# EAGLE design ChargeControllerRevA (EAGLE 7.2.0)
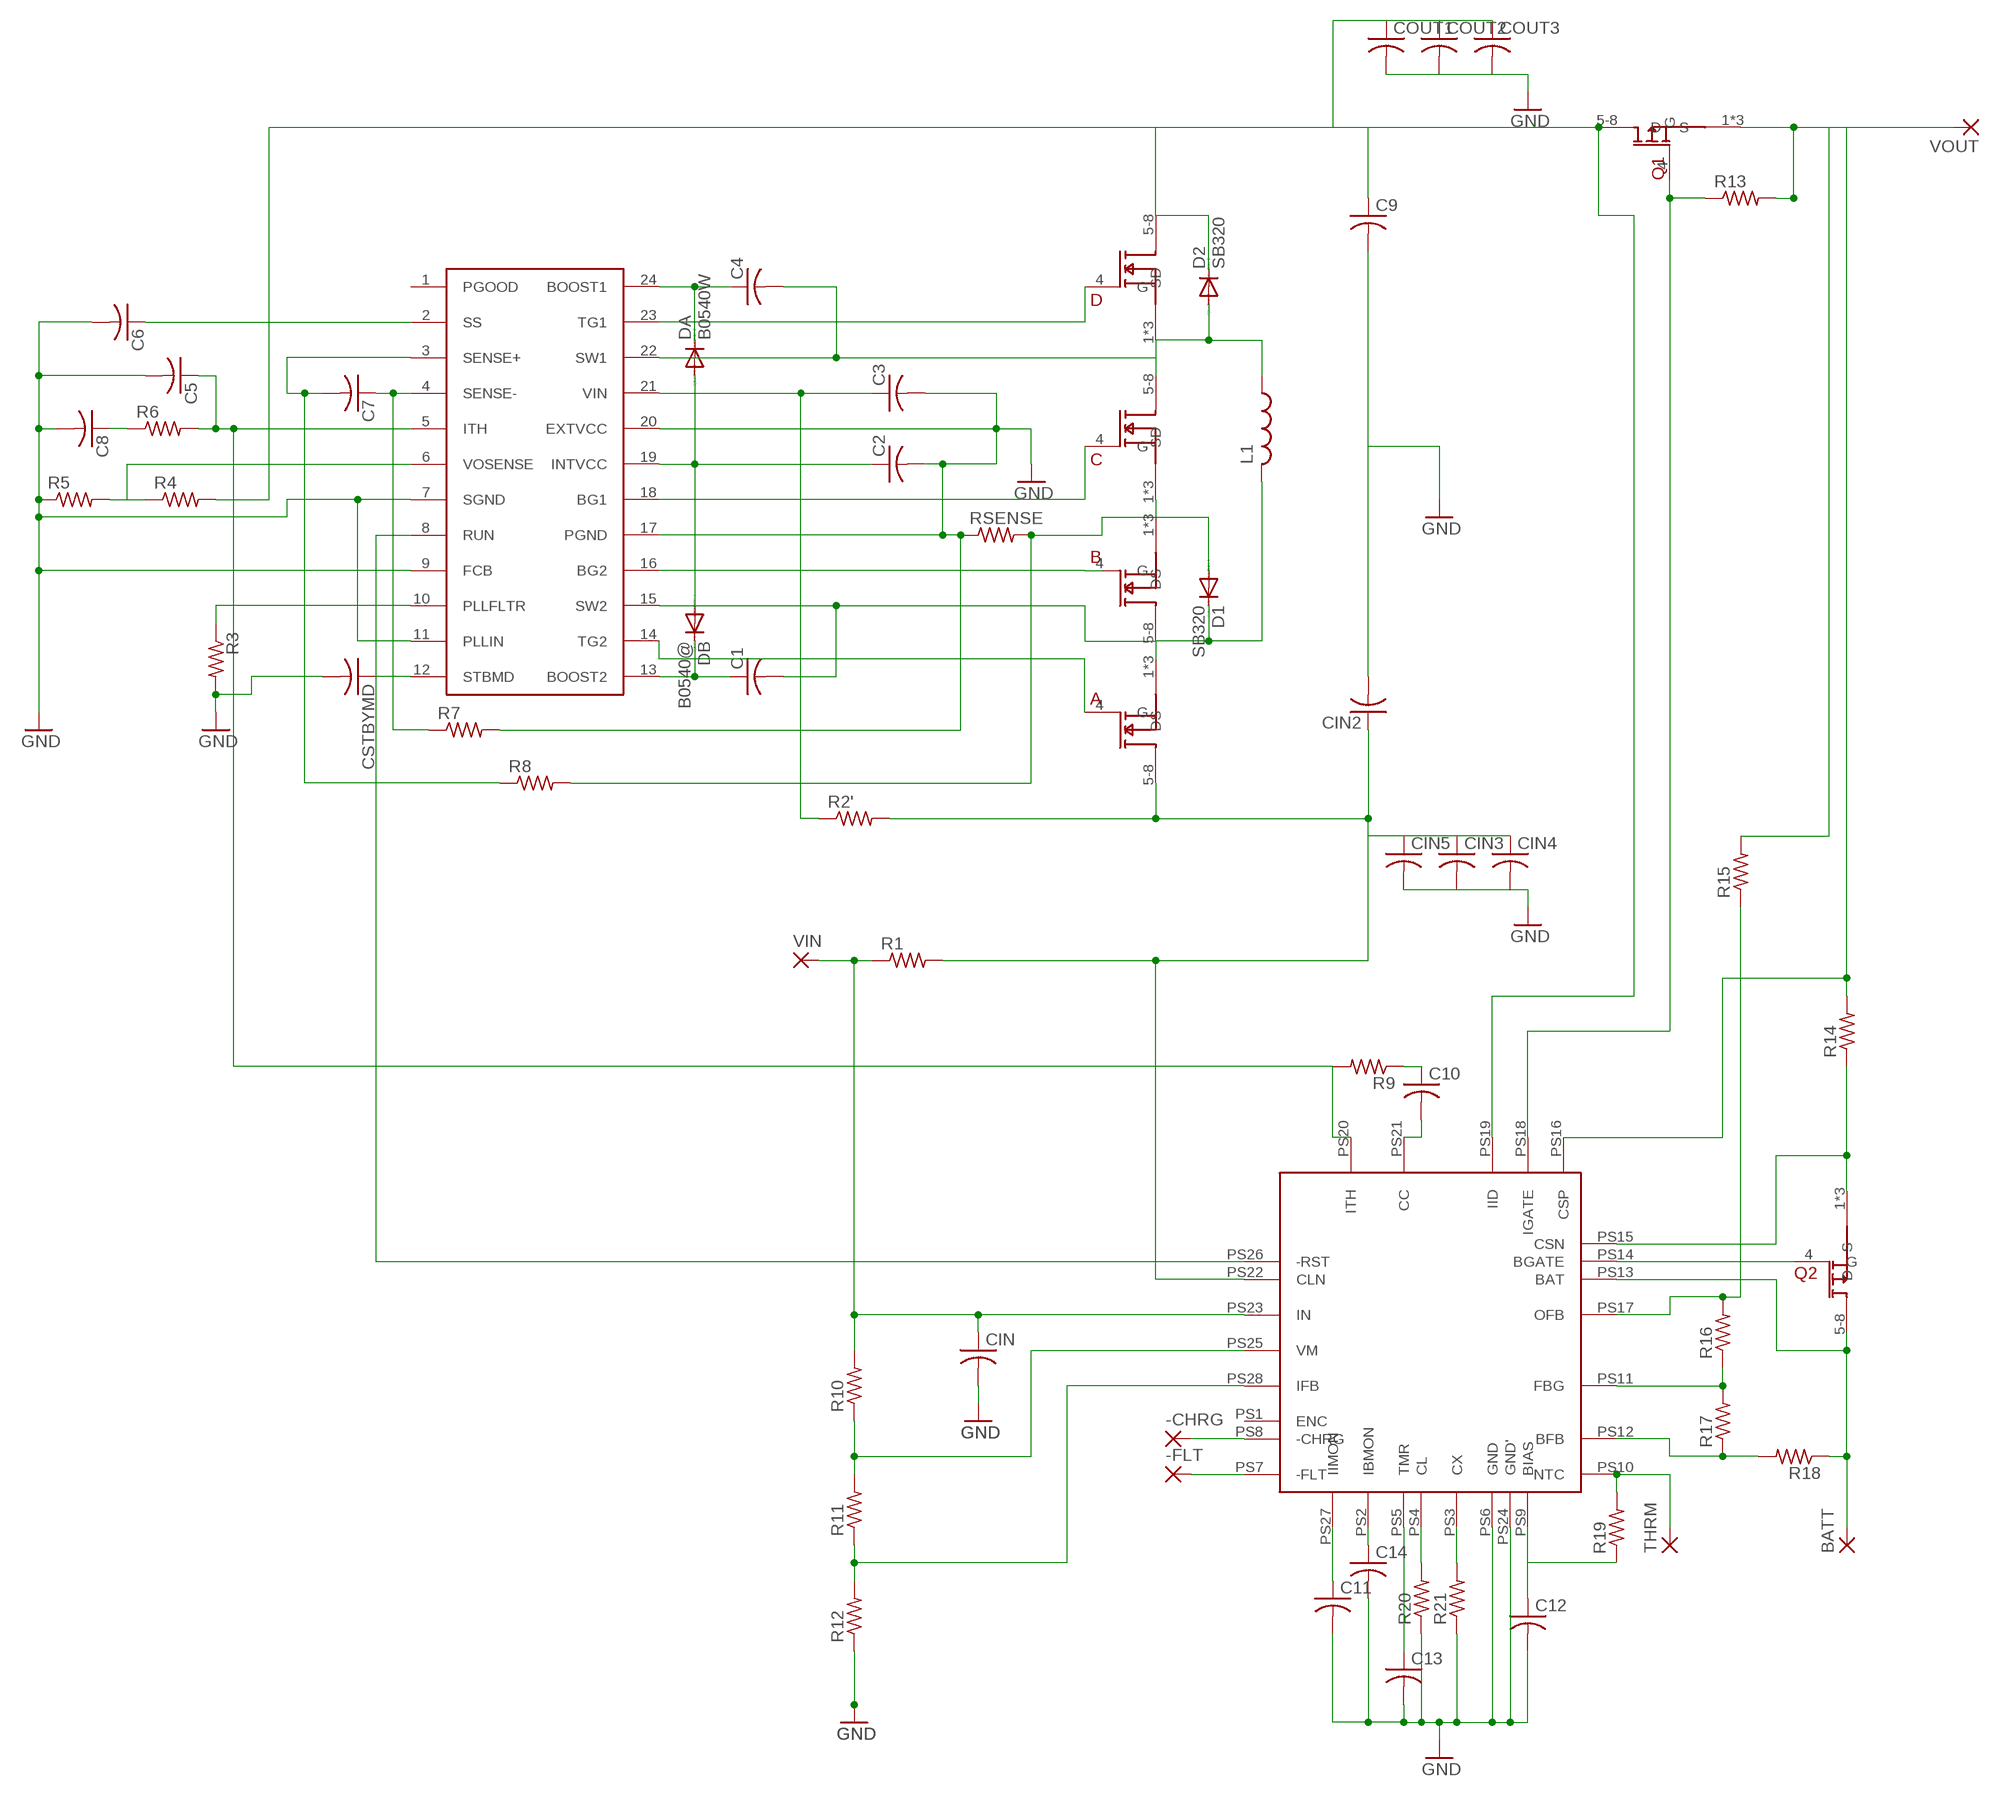
[diagram p0: schematic, sheet 1]

## Parts
-CHRG  3,81/1,4  [3,81/1,4]
-FLT  3,81/1,4  [3,81/1,4]
A  SI7884DP  [POWERPAK-SO-08]
B  SI7884DP  [POWERPAK-SO-08]
BATT  3,81/1,4  [3,81/1,4]
C  SI7884DP  [POWERPAK-SO-08]
C1  C-US025-050X050  [C025-050X050]
C2  C-US025-050X050  [C025-050X050]
C3  C-US025-050X050  [C025-050X050]
C4  C-US025-050X050  [C025-050X050]
C5  C-US025-050X050  [C025-050X050]
C6  C-US025-050X050  [C025-050X050]
C7  C-US025-050X050  [C025-050X050]
C8  C-US025-050X050  [C025-050X050]
C9  C-US025-050X050  [C025-050X050]
C10  C-US025-050X050  [C025-050X050]
C11  C-US025-050X050  [C025-050X050]
C12  C-US025-050X050  [C025-050X050]
C13  C-US025-050X050  [C025-050X050]
C14  C-US025-050X050  [C025-050X050]
CIN  C-US025-050X050  [C025-050X050]
CIN2  C-US025-050X050  [C025-050X050]
CIN3  C-US025-050X050  [C025-050X050]
CIN4  C-US025-050X050  [C025-050X050]
CIN5  C-US025-050X050  [C025-050X050]
COUT1  C-US025-050X050  [C025-050X050]
COUT2  C-US025-050X050  [C025-050X050]
COUT3  C-US025-050X050  [C025-050X050]
CSTBYMD  C-US025-050X050  [C025-050X050]
D  SI7884DP  [POWERPAK-SO-08]
D1  SB320  [DO201-15]
D2  SB320  [DO201-15]
DA  B0540W  MBR0520LT  [SOD123]
DB  B0540@  MBR0520LT  [SOD123]
L1  L-US6000-XXX-RC  [6000-XXXX-RC]
Q1  SI7135DP  [POWERPAK-SO-08]
Q2  SI7135DP  [POWERPAK-SO-08]
R1  R-US_0309/12  [0309/12]
R2'  R-US_0309/12  [0309/12]
R3  R-US_0309/12  [0309/12]
R4  R-US_0309/12  [0309/12]
R5  R-US_0309/12  [0309/12]
R6  R-US_0309/12  [0309/12]
R7  R-US_0309/12  [0309/12]
R8  R-US_0309/12  [0309/12]
R9  R-US_0309/12  [0309/12]
R10  R-US_0309/12  [0309/12]
R11  R-US_0309/12  [0309/12]
R12  R-US_0309/12  [0309/12]
R13  R-US_0309/12  [0309/12]
R14  R-US_0309/12  [0309/12]
R15  R-US_0309/12  [0309/12]
R16  R-US_0309/12  [0309/12]
R17  R-US_0309/12  [0309/12]
R18  R-US_0309/12  [0309/12]
R19  R-US_0309/12  [0309/12]
R20  R-US_0309/12  [0309/12]
R21  R-US_0309/12  [0309/12]
RSENSE  R-US_0309/12  [0309/12]
THRM  3,81/1,4  [3,81/1,4]
U$1  LT3780  [SSOP24]
U$2  LTC4000-1  LTC4000-1(B)GN  [SSOP-28_GN]
VIN  3,81/1,4  [3,81/1,4]
VOUT  3,81/1,4  [3,81/1,4]

## Nets
BATT: BATT.1(P) Q2.5-8(D) R18.1 U$2.PS13(BAT)
GND: C2.2 C3.2 C5.2 C6.2 C8.2 C9.2 C11.2 C12.2 C13.2 C14.2 CIN2.2 CIN3.2 CIN4.2 CIN5.2 CIN.2 COUT1.2 COUT2.2 COUT3.2 CSTBYMD.2 R3.2 R5.1 R7.2 R12.1 R20.1 R21.1 RSENSE.1 U$1.7(SGND) U$1.9(FCB) U$1.11(PLLIN) U$1.17(PGND) U$1.20(EXTVCC) U$2.PS6(GND) U$2.PS24(GND')
N$1: C6.1 U$1.2(SS)
N$2: C7.1 R7.1 U$1.4(SENSE-)
N$3: C7.2 R8.1 U$1.3(SENSE+)
N$4: C5.1 R6.2 R9.2 U$1.5(ITH) U$2.PS20(ITH)
N$5: C8.1 R6.1
N$7: R4.1 R5.2 U$1.6(VOSENSE)
N$9: B.4(G) U$1.16(BG2)
N$10: R3.1 U$1.10(PLLFLTR)
N$11: C4.1 DA.C U$1.24(BOOST1)
N$12: C3.1 R2'.1 U$1.21(VIN)
N$13: C2.1 DA.A DB.A U$1.19(INTVCC)
N$14: CSTBYMD.1 U$1.12(STBMD)
N$16: B.1(S) B.2(S) B.3(S) C.1(S) C.2(S) C.3(S) D1.A R8.2 RSENSE.2
N$17: U$1.8(RUN) U$2.PS26(-RST)
N$19: C10.1 R9.1
N$20: C1.1 DB.C U$1.13(BOOST2)
N$21: Q1.1(S) Q1.2(S) Q1.3(S) R13.2 R14.2 R15.2 U$2.PS16(CSP) VOUT.1(P)
N$22: D.4(G) U$1.23(TG1)
N$23: C.4(G) U$1.18(BG1)
N$24: A.4(G) U$1.14(TG2)
N$25: Q1.4(G) R13.1 U$2.PS18(IGATE)
N$26: C10.2 U$2.PS21(CC)
N$28: R10.1 R11.2 U$2.PS25(VM)
N$29: R11.1 R12.2 U$2.PS28(IFB)
N$31: -FLT.1(P) U$2.PS7(-FLT)
N$32: C11.1 U$2.PS27(IIMON)
N$33: C14.1 U$2.PS2(IBMON)
N$34: C13.1 U$2.PS5(TMR)
N$35: R20.2 U$2.PS4(CL)
N$36: R21.2 U$2.PS3(CX)
N$37: C12.1 R19.1 U$2.PS9(BIAS)
N$38: -CHRG.1(P) U$2.PS8(-CHRG)
N$39: R19.2 THRM.1(P) U$2.PS10(NTC)
N$40: R16.1 R17.2 U$2.PS11(FBG)
N$41: R17.1 R18.2 U$2.PS12(BFB)
N$42: R15.1 R16.2 U$2.PS17(OFB)
N$44: Q2.4(G) U$2.PS14(BGATE)
N$45: Q2.1(S) Q2.2(S) Q2.3(S) R14.1 U$2.PS15(CSN)
SW1: C4.2 C.5-8(D) D2.A D.1(S) D.2(S) D.3(S) L1.1 U$1.22(SW1)
SW2: A.1(S) A.2(S) A.3(S) B.5-8(D) C1.2 D1.C L1.2 U$1.15(SW2)
VIN: A.5-8(D) CIN2.1 CIN3.1 CIN4.1 CIN5.1 R1.2 R2'.2 U$2.PS22(CLN)
VIN+: CIN.1 R1.1 R10.2 U$2.PS23(IN) VIN.1(P)
VOUT(1): C9.1 COUT1.1 COUT2.1 COUT3.1 D2.C D.5-8(D) Q1.5-8(D) R4.2 U$2.PS19(IID)
Unconnected: U$1.1(PGOOD) U$2.PS1(ENC)

## Library data of the parts
-CHRG -FLT BATT THRM VIN VOUT = wirepad:3,81/1,4: THROUGH-HOLE PAD
A B C D = SeniorDesign:SI7884DP
C1-C14 CIN CIN2-CIN5 COUT1-COUT3 CSTBYMD = rcl:C-US: CAPACITOR, American symbol
D1 D2 = diode:SB320: DIODE barrier rectifier, 3 A (Fairchild)
DA DB = diode:MBR0520LT: SCHOTTKY BARRIER RECTIFIER Source: http://onsemi.com .. MBR0520LT1-D.pdf
L1 = rcl:L-US: INDUCTOR, American symbol
Q1 Q2 = SeniorDesign:SI7135DP
R1 R2' R3-R21 RSENSE = rcl:R-US_: RESISTOR, American symbol
U$1 = SeniorDesign:LT3780
U$2 = SeniorDesign:LTC4000-1(B)

## Board
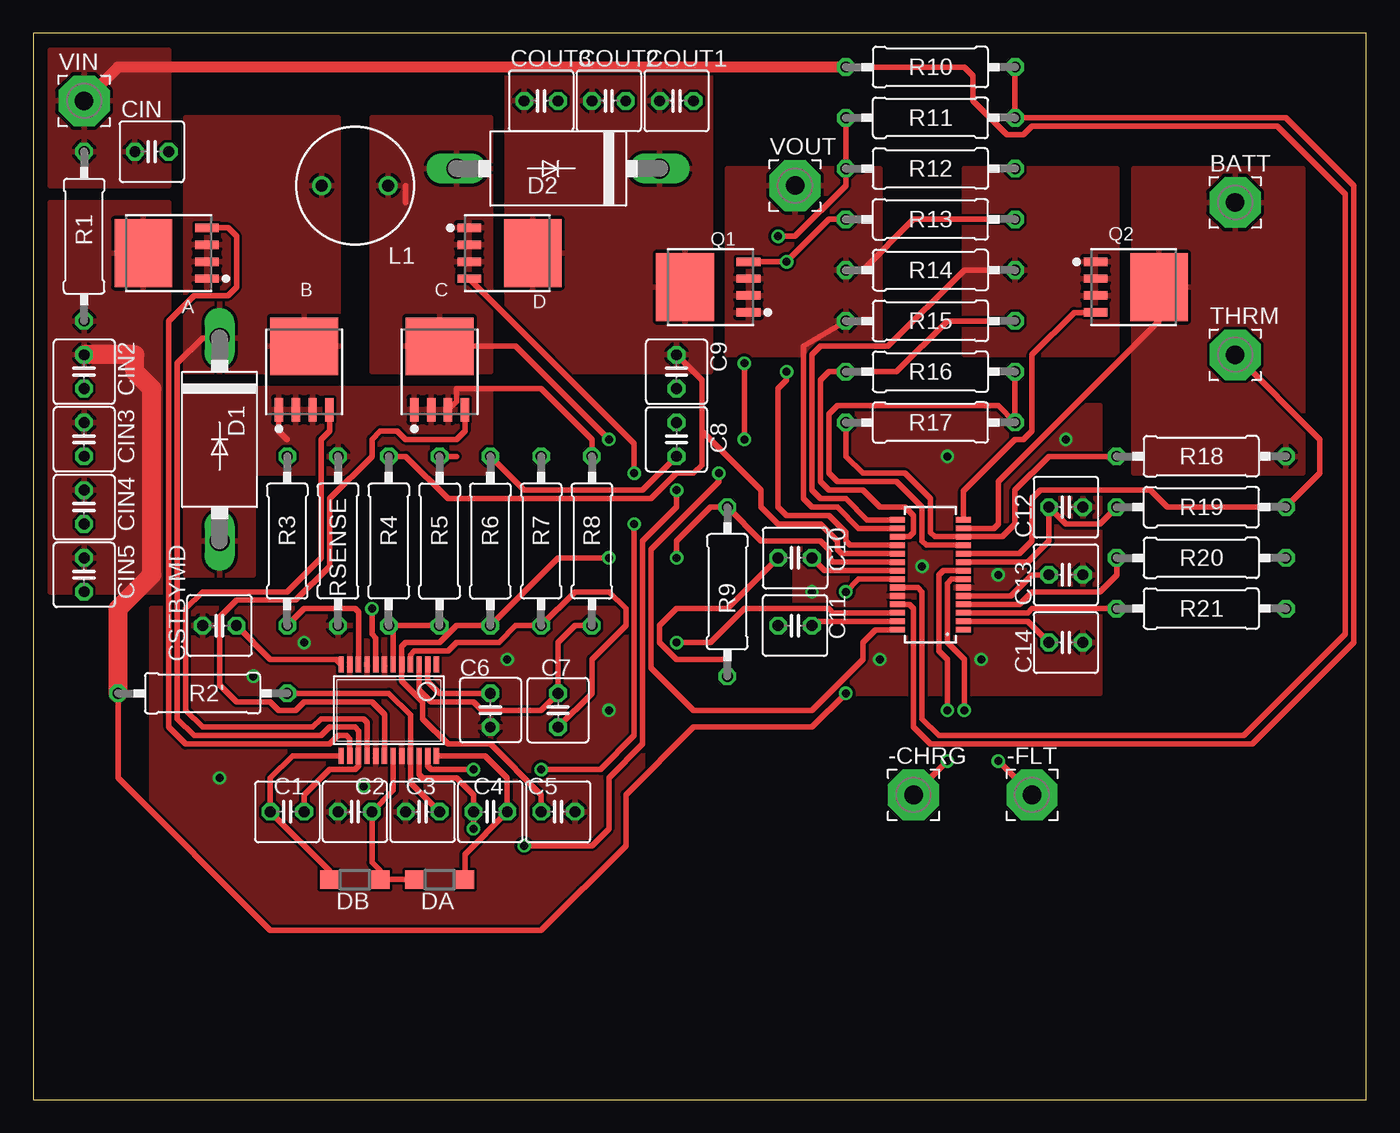
[diagram p1: board, top side]
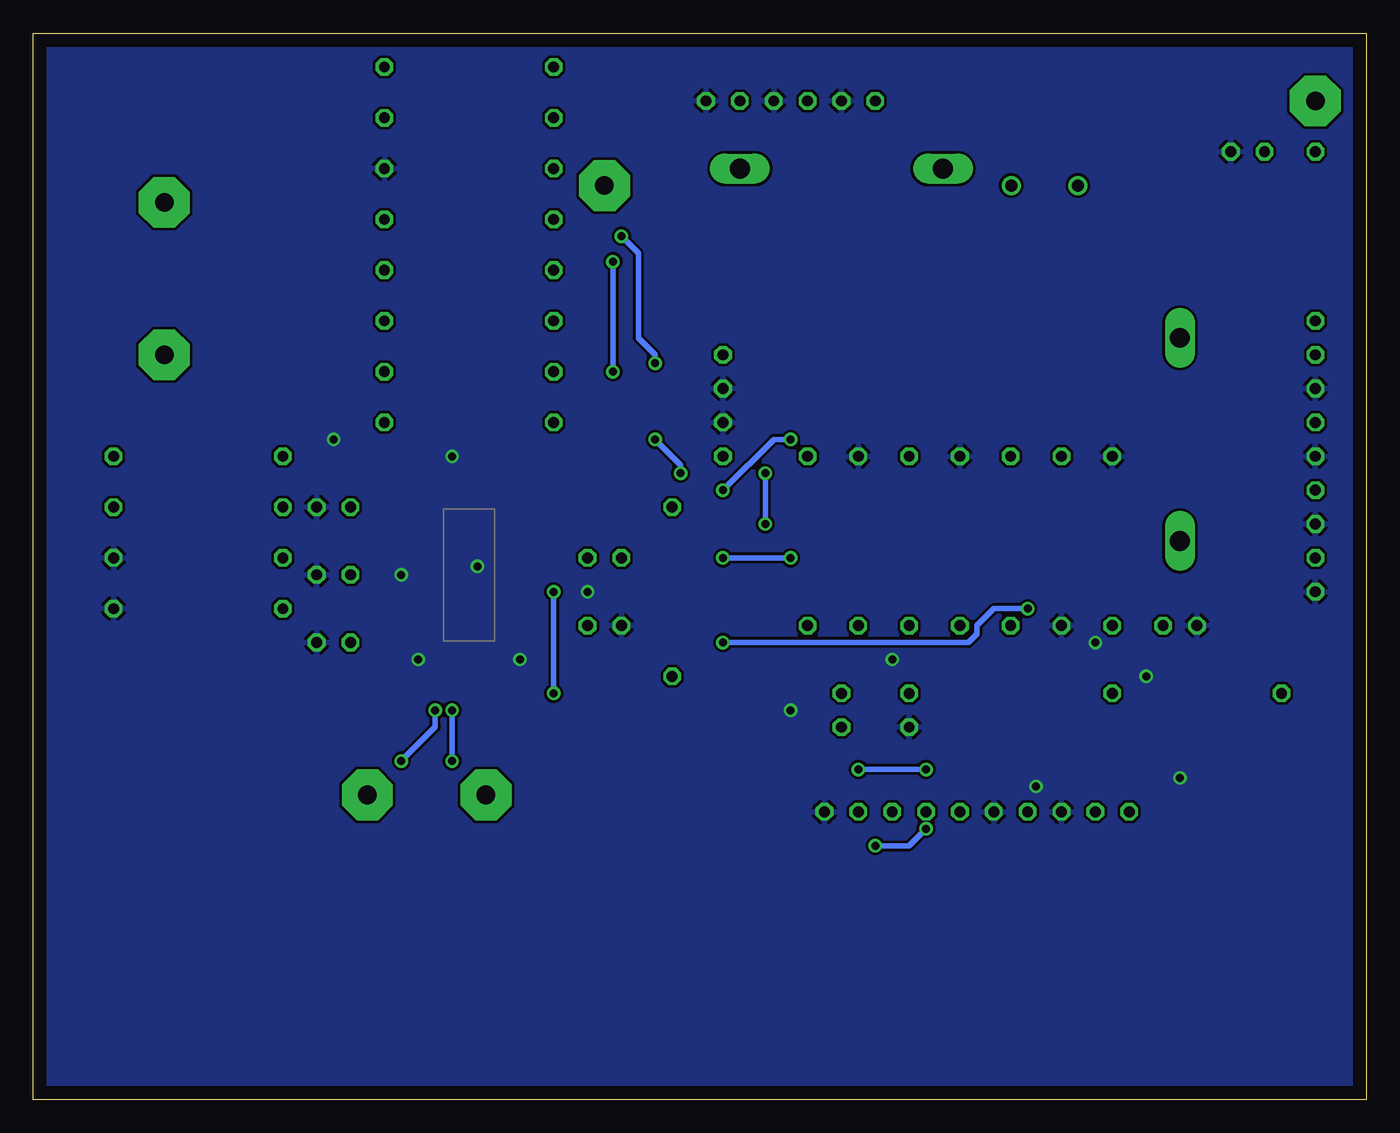
[diagram p2: board, bottom side, seen from below]

Size 100 x 80 mm. Coordinates in mm from the lower left corner, seen from the top.
Outline: 0,0 100,0 100,80 0,80 0,0
Copper layers (1*16): Top 0.035mm / dielectric 1.5mm / Bottom 0.035mm
Design rules "default": minimum track width 10mil, minimum drill 24mil, track to track 8mil, track to pad 8mil, pad to pad 8mil, via to via 8mil, smd to smd 8mil, copper to edge 40mil, drill to drill 8mil, minimum pad ring 10mil, minimum via ring 8mil, stop-mask expansion 4mil, vias tented up to drill 0mil, thermal gap 10mil

### Footprints (pad centres in the part's own frame; a part is rotated, then mirrored left to right if it is on the bottom)
3,81/1,4 = drill 1.397 pad 3.81 octagon: 1 0,0
POWERPAK-SO-08 = smd 0.635 x 1.778: 1 -1.905,-2.857; 2 -0.635,-2.857; 3 0.635,-2.857; 4 1.905,-2.857 | smd 5.08 x 4.318: 5-8 0,1.905
C025-050X050 = drill 0.813 octagon: 1 -1.27,0; 2 1.27,0
DO201-15 = drill 1.499 long: A 7.62,0; C -7.62,0
SOD123 = smd 1.4 x 1.4: A 1.9,0; C -1.9,0
6000-XXXX-RC = drill 0.9 pad 1.422: 1 -2.5,0; 2 2.5,0
0309/12 = drill 0.813 octagon: 1 -6.35,0; 2 6.35,0
SSOP24 = smd 0.4 x 1.2: 1 -3.575,-3.42; 2 -2.925,-3.42; 3 -2.275,-3.42; 4 -1.625,-3.42; 5 -0.975,-3.42; 6 -0.325,-3.42; 7 0.325,-3.42; 8 0.975,-3.42; 9 1.625,-3.42; 10 2.275,-3.42; 11 2.925,-3.42; 12 3.575,-3.42; 13 3.575,3.42; 14 2.925,3.42; 15 2.275,3.42; 16 1.625,3.42; 17 0.975,3.42; 18 0.325,3.42; 19 -0.325,3.42; 20 -0.975,3.42; 21 -1.625,3.42; 22 -2.275,3.42; 23 -2.925,3.42; 24 -3.575,3.42
SSOP-28_GN = smd 0.419 x 1.143: PS1 -4.128,-2.477; PS2 -3.493,-2.477; PS3 -2.857,-2.477; PS4 -2.223,-2.477; PS5 -1.587,-2.477; PS6 -0.953,-2.477; PS7 -0.318,-2.477; PS8 0.318,-2.477; PS9 0.953,-2.477; PS10 1.587,-2.477; PS11 2.223,-2.477; PS12 2.857,-2.477; PS13 3.493,-2.477; PS14 4.128,-2.477; PS15 4.128,2.477; PS16 3.493,2.477; PS17 2.857,2.477; PS18 2.223,2.477; PS19 1.587,2.477; PS20 0.953,2.477; PS21 0.318,2.477; PS22 -0.318,2.477; PS23 -0.953,2.477; PS24 -1.587,2.477; PS25 -2.223,2.477; PS26 -2.857,2.477; PS27 -3.493,2.477; PS28 -4.128,2.477

### Placement (x,y rotation side)
-CHRG  66.04,22.86 0 top
-FLT  74.93,22.86 0 top
A  10.16,63.5 90 top
B  20.32,54.61 0 top
BATT  90.17,67.31 0 top
C  30.48,54.61 0 top
C1  19.05,21.59 0 top
C2  24.13,21.59 180 top
C3  29.21,21.59 180 top
C4  34.29,21.59 180 top
C5  39.37,21.59 0 top
C6  34.29,29.21 270 top
C7  39.37,29.21 90 top
C8  48.26,49.53 90 top
C9  48.26,54.61 270 top
C10  57.15,40.64 0 top
C11  57.15,35.56 180 top
C12  77.47,44.45 0 top
C13  77.47,39.37 0 top
C14  77.47,34.29 0 top
CIN  8.89,71.12 0 top
CIN2  3.81,54.61 270 top
CIN3  3.81,49.53 270 top
CIN4  3.81,44.45 270 top
CIN5  3.81,39.37 270 top
COUT1  48.26,74.93 0 top
COUT2  43.18,74.93 0 top
COUT3  38.1,74.93 0 top
CSTBYMD  13.97,35.56 180 top
D  35.56,63.5 270 top
D1  13.97,49.53 270 top
D2  39.37,69.85 180 top
DA  30.48,16.51 180 top
DB  24.13,16.51 0 top
L1  24.13,68.58 180 top
Q1  50.8,60.96 90 top
Q2  82.55,60.96 270 top
R1  3.81,64.77 270 top
R2'  12.7,30.48 180 top
R3  19.05,41.91 90 top
R4  26.67,41.91 90 top
R5  30.48,41.91 270 top
R6  34.29,41.91 270 top
R7  38.1,41.91 90 top
R8  41.91,41.91 90 top
R9  52.07,38.1 90 top
R10  67.31,77.47 180 top
R11  67.31,73.66 0 top
R12  67.31,69.85 180 top
R13  67.31,66.04 0 top
R14  67.31,62.23 180 top
R15  67.31,58.42 180 top
R16  67.31,54.61 180 top
R17  67.31,50.8 0 top
R18  87.63,48.26 180 top
R19  87.63,44.45 0 top
R20  87.63,40.64 180 top
R21  87.63,36.83 180 top
RSENSE  22.86,41.91 90 top
THRM  90.17,55.88 0 top
U$1  26.67,29.21 180 top
U$2  67.31,39.37 90 top
VIN  3.81,74.93 0 top
VOUT  57.15,68.58 0 top

### Tracks (layer width: path | path; a pad name or v marks a point on that pad's centre or on a via)
BATT
  Top 0.406: Q2.5-8 84.45,58.42 72.39,46.35 72.39,43.18 72.07,42.86 U$2.PS13
  pour Top: 95.25,69.85 82.55,69.85 82.55,46.99 95.25,46.99
GND  (via drill 0.6)
  Top 0.406: R5.1 31.75,48.26
  other vias: 43.18,29.21 35.56,33.02 20.32,34.29 20.32,34.29 16.51,31.75 16.51,31.75 16.51,31.75 13.97,24.13 13.97,24.13 13.97,24.13 24.77,23.5 71.12,33.02 63.5,33.02 72.39,39.37 58.42,38.1 68.58,48.26 77.47,49.53 66.67,40.01
  pour Bottom: -1.27,-2.54 101.6,-2.54 101.6,5.08 101.6,81.28 -1.27,81.28
  pour Top: 8.89,36.83 45.72,36.83 45.72,11.43 8.89,11.43
  pour Top: 57.15,52.07 57.15,30.48 80.01,30.48 80.01,33.02 80.01,52.07
N$1
  Top 0.406: U$1.2 29.59,31.36 30.48,30.48 C6.1
N$2
  Top 0.406: U$1.4 28.3,33.38 28.57,33.66 31.11,33.66 31.75,34.29 34.92,34.29 36.2,35.56 R7.1 40.64,38.1 43.18,38.1 44.45,36.83 44.45,35.56 41.91,33.02 41.91,30.48 C7.1
N$3
  Top 0.406: R8.1 40.64,35.56 39.37,34.29 C7.2 38.1,29.21 33.66,29.21 33.02,29.84 29.84,29.84 28.95,30.75 U$1.3
N$4  (via drill 0.6)
  Top 0.406: C5.1 38.1,22.86 34.29,26.67 31.11,26.67 29.21,28.57 29.21,29.84 27.64,31.41 U$1.5 27.64,33.99 27.94,34.29 30.48,34.29 31.75,35.56 R6.2 39.37,40.64 v43.18,40.64 | v48.26,40.64 48.26,41.91 50.8,44.45 R9.2 54.61,41.91 59.05,41.91 59.69,41.27 59.69,40.64 60.01,40.32 U$2.PS20
  Bottom 0.406: v43.18,40.64 v48.26,40.64
N$5
  Top 0.406: R6.1 36.83,45.72 45.72,45.72 C8.1
N$6  (via drill 0.6)
  other vias: 45.09,46.99
N$7
  Top 0.406: U$1.6 27,35.23 R4.1 R5.2
N$8  (via drill 0.6)
  other vias: 48.26,45.72
N$9
  Top 0.406: U$1.16 25.05,28.3 24.77,28.57 21.59,28.57 20.95,27.94 12.7,27.94 11.43,29.21 11.43,36.83 12.7,38.1 19.05,38.1 21.59,40.64 21.59,49.53 22.23,50.16 B.4
N$10
  Top 0.406: R3.1 20.32,36.83 24.13,36.83 24.39,36.56 U$1.10
N$11
  Top 0.406: DA.C 32.38,18.41 C4.1 35.56,24.13 33.9,25.79 U$1.24
N$12
  Top 0.406: C3.1 28.3,23.77 U$1.21 28.3,28.86 26.67,30.48 R2'.1
N$13
  Top 0.406: DA.A 26.67,16.51 | 26.67,16.51 DB.A | U$1.19 27,23.18 C2.1 25.4,17.78 26.67,16.51
N$14
  Top 0.406: CSTBYMD.1 17.78,33.02 22.7,33.02 U$1.12
N$15  (via drill 0.6)
  other vias: 33.02,20.32
N$16
  Top 0.406: B.1 18.41,50.16 19.05,49.53 | R8.2 41.91,49.53 38.1,53.34 31.75,53.34 31.75,52.39 C.3
  pour Top: 11.43,53.34 34.29,53.34 34.29,46.99 16.51,46.99 16.51,39.37 11.43,39.37
N$17  (via drill 0.6)
  Top 0.406: U$1.8 25.7,34.63 25.4,34.92 v25.4,36.83 | v48.26,34.29 50.8,34.29 53.34,36.83 59.69,36.83 60.01,36.51 U$2.PS26
  Bottom 0.406: v25.4,36.83 27.94,36.83 29.21,35.56 29.21,34.92 29.84,34.29 v48.26,34.29
N$19
  Top 0.406: R9.1 52.07,33.02 48.26,33.02 46.99,34.29 46.99,35.56 48.26,36.83 52.07,36.83 C10.1
N$20
  Top 0.406: DB.C 22.23,17.14 C1.1 17.78,24.13 19.44,25.79 U$1.13
N$21
  Top 0.406: R14.2 62.23,62.23 66.04,66.04 R13.2 | R15.2 57.78,56.52 57.78,45.09 58.42,44.45 60.33,44.45 61.91,42.86 U$2.PS16
  pour Top: 63.5,69.85 63.5,55.88 52.07,55.88 52.07,58.42 52.07,69.85
N$22  (via drill 0.6)
  Top 0.406: U$1.23 29.59,25.02 29.84,24.77 v33.02,24.77 | v45.09,46.99 45.09,49.21 D.4 | v45.09,43.18 45.09,27.3 42.55,24.77 v38.1,24.77
  Bottom 0.406: v33.02,24.77 v38.1,24.77 | v45.09,43.18 v45.09,46.99
N$23
  Top 0.406: U$1.18 26.34,28.9 25.4,29.84 20.32,29.84 19.68,29.21 18.41,29.21 17.78,29.84 15.24,29.84 13.97,31.11 13.97,36.2 15.24,37.47 19.68,37.47 22.23,40.01 22.23,45.09 25.4,48.26 25.4,49.53 26.04,50.16 27.3,50.16 27.94,49.53 31.75,49.53 32.38,50.16 C.4
N$24
  Top 0.406: U$1.14 23.75,27.05 23.5,27.3 22.86,27.3 22.23,26.67 11.43,26.67 10.16,27.94 10.16,58.42 12.06,60.33 14.61,60.33 15.24,60.96 15.24,64.77 14.61,65.41 A.4
N$25  (via drill 0.6)
  Top 0.406: Q1.4 v56.52,62.87 59.69,66.04 R13.1 | v56.52,54.61 56.52,53.98 55.88,53.34 55.88,44.45 56.52,43.81 59.69,43.81 60.96,42.55 60.96,41.91 61.28,41.59 U$2.PS18
  Bottom 0.406: v56.52,62.87 v56.52,54.61
N$26
  Top 0.406: C10.2 59.37,39.69 U$2.PS21
N$27  (via drill 0.6)
  other vias: 48.26,40.64
N$28
  Top 0.406: R10.1 R11.2 93.98,73.66 99.06,68.58 99.06,34.29 91.44,26.67 67.31,26.67 66.04,27.94 66.04,36.83 65.72,37.15 U$2.PS25
N$29  (via drill 0.6)
  Top 0.406: R11.1 R12.2 | v51.44,46.99 51.44,46.35 46.35,41.27 46.35,32.38 49.53,29.21 58.42,29.21 62.23,33.02 62.23,34.29 63.18,35.24 U$2.PS28 | v53.34,49.53 v53.34,55.24 | R12.2 62.23,69.85 | v55.88,64.77 57.15,64.77 60.96,68.58 R12.2
  Bottom 0.406: v51.44,46.99 51.44,47.62 v53.34,49.53 | v53.34,55.24 53.34,55.88 54.61,57.15 54.61,63.5 v55.88,64.77
N$30  (via drill 0.6)
  other vias: 51.44,46.99
N$31  (via drill 0.6)
  Top 0.406: -FLT.1 v72.39,25.4 | U$2.PS7 68.9,39.05 68.58,38.73 68.58,34.29 69.85,33.02 v69.85,29.21
  Bottom 0.406: v72.39,25.4 69.85,27.94 v69.85,29.21
N$32
  Top 0.406: 58.66,35.8 C11.1 58.74,35.88 U$2.PS27
N$33
  Top 0.406: C14.1 74.61,35.88 U$2.PS2
N$34
  Top 0.406: U$2.PS5 73.34,37.78 74.93,39.37 C13.1
N$35
  Top 0.406: U$2.PS4 73.98,37.15 74.93,38.1 80.01,38.1 81.28,39.37 R20.2
N$36
  Top 0.406: R21.2 74.93,36.83 74.61,36.51 U$2.PS3
N$37
  Top 0.406: U$2.PS9 74.61,40.32 76.2,41.91 C12.1 77.47,43.18 80.01,43.18 R19.1
N$38  (via drill 0.6)
  Top 0.406: v68.58,25.4 -CHRG.1 | U$2.PS8 68.26,39.69 67.94,39.37 67.94,33.66 68.58,33.02 v68.58,29.21
  Bottom 0.406: v68.58,29.21 v68.58,25.4
N$39
  Top 0.406: THRM.1 96.52,49.53 96.52,46.99 R19.2 85.09,44.45 83.82,45.72 75.56,45.72 74.93,45.09 74.93,41.91 73.98,40.96 U$2.PS10
N$40
  Top 0.406: R16.1 R17.2 72.39,52.07 60.33,52.07 59.69,51.44 59.69,46.99 60.33,46.35 64.77,46.35 66.67,44.45 66.67,41.91 66.99,41.59 U$2.PS11
N$41
  Top 0.406: R17.1 60.96,48.26 62.23,46.99 65.41,46.99 67.31,45.09 67.31,42.55 67.63,42.23 U$2.PS12 72.71,42.23 73.66,43.18 73.66,45.72 76.2,48.26 R18.2
N$42
  Top 0.406: R15.1 68.58,58.42 64.77,54.61 R16.2 59.69,54.61 59.05,53.98 59.05,46.35 59.69,45.72 62.23,45.72 63.5,44.45 65.41,44.45 66.04,43.81 66.04,42.55 65.72,42.23 U$2.PS17
N$43  (via drill 0.6)
  other vias: 53.34,49.53
N$44
  Top 0.406: Q2.4 78.11,59.05 74.93,55.88 74.93,50.16 74.3,49.53 73.66,49.53 69.79,45.66 U$2.PS14
N$45
  Top 0.406: R14.1 69.85,62.23 64.14,56.52 59.05,56.52 58.42,55.88 58.42,45.72 59.05,45.09 60.96,45.09 62.55,43.5 U$2.PS15
  pour Top: 81.28,69.85 81.28,55.88 69.85,55.88 69.85,58.42 69.85,69.85
  pour Top: 81.28,69.85 81.28,55.88 69.85,55.88 69.85,58.42 69.85,69.85
N$46  (via drill 0.6)
  other vias: 56.52,54.61
N$47  (via drill 0.6)
  other vias: 60.96,30.48
N$48  (via drill 0.6)
  other vias: 69.85,29.21
N$49  (via drill 0.6)
  other vias: 68.58,25.4
N$50  (via drill 0.6)
  other vias: 72.39,25.4
N$51  (via drill 0.6)
  other vias: 55.88,64.77
SW1  (via drill 0.6)
  Top 0.406: 27.94,68.58 27.94,67.31 | U$1.22 28.95,24.39 29.21,24.13 31.75,24.13 33.02,22.86 C4.2 v33.02,20.32 | C.5-8 36.2,56.52 v43.18,49.53 | v48.26,45.72 48.26,44.45 45.72,41.91 45.72,26.67 43.18,24.13 43.18,20.32 41.91,19.05 v36.83,19.05
  Bottom 0.406: v43.18,49.53 44.45,49.53 v48.26,45.72 | v36.83,19.05 34.29,19.05 v33.02,20.32
  pour Top: 34.29,54.61 34.29,73.66 25.4,73.66 25.4,54.61
SW2
  Top 0.406: C1.2 20.32,22.86 22.23,24.77 24.13,24.77 24.39,25.03 U$1.15 24.39,27.68 24.13,27.94 22.23,27.94 21.59,27.3 12.06,27.3 10.79,28.57 10.79,55.24 12.7,57.15 D1.C
  pour Top: 22.86,73.66 22.86,54.61 11.43,54.61 11.43,73.66
VIN  (via drill 0.6)
  Top 0.406: v60.96,38.1 61.91,39.05 U$2.PS22 | v60.96,30.48 58.42,27.94 49.53,27.94 44.45,22.86 44.45,19.05 38.1,12.7 17.78,12.7 6.35,24.13 R2'.2
  Top 1.422: R2'.2 6.35,36.83 8.89,39.37 8.89,53.34 7.62,54.61 7.62,55.88 CIN2.1
  Bottom 0.406: v60.96,38.1 v60.96,30.48
  pour Top: 10.16,67.31 10.16,38.1 1.27,38.1 1.27,67.31
VIN+
  Top 0.406: R10.2 69.85,77.47 70.48,76.83 70.48,74.93 73.03,72.39 74.3,72.39 74.93,73.03 93.34,73.03 98.42,67.94 98.42,34.92 90.81,27.3 67.94,27.3 66.67,28.57 66.67,38.1 66.36,38.42 U$2.PS23
  Top 0.813: R10.2 6.35,77.47 VIN.1
  pour Top: 1.27,78.74 1.27,68.58 10.16,68.58 10.16,78.74
VOUT(1)
  Top 0.406: R4.2 27.94,48.26 31.11,45.09 46.35,45.09 48.26,46.99 49.53,46.99 50.16,47.62 50.16,50.16 | 50.16,50.16 50.16,53.98 C9.1 | 50.16,50.16 54.61,45.72 54.61,44.45 55.88,43.18 59.05,43.18 60.33,41.91 60.33,41.27 60.64,40.96 U$2.PS19
  pour Top: 35.56,54.61 50.8,54.61 50.8,78.74 35.56,78.74